# EAGLE schematic re-gotcha (EAGLE 9.5.2)
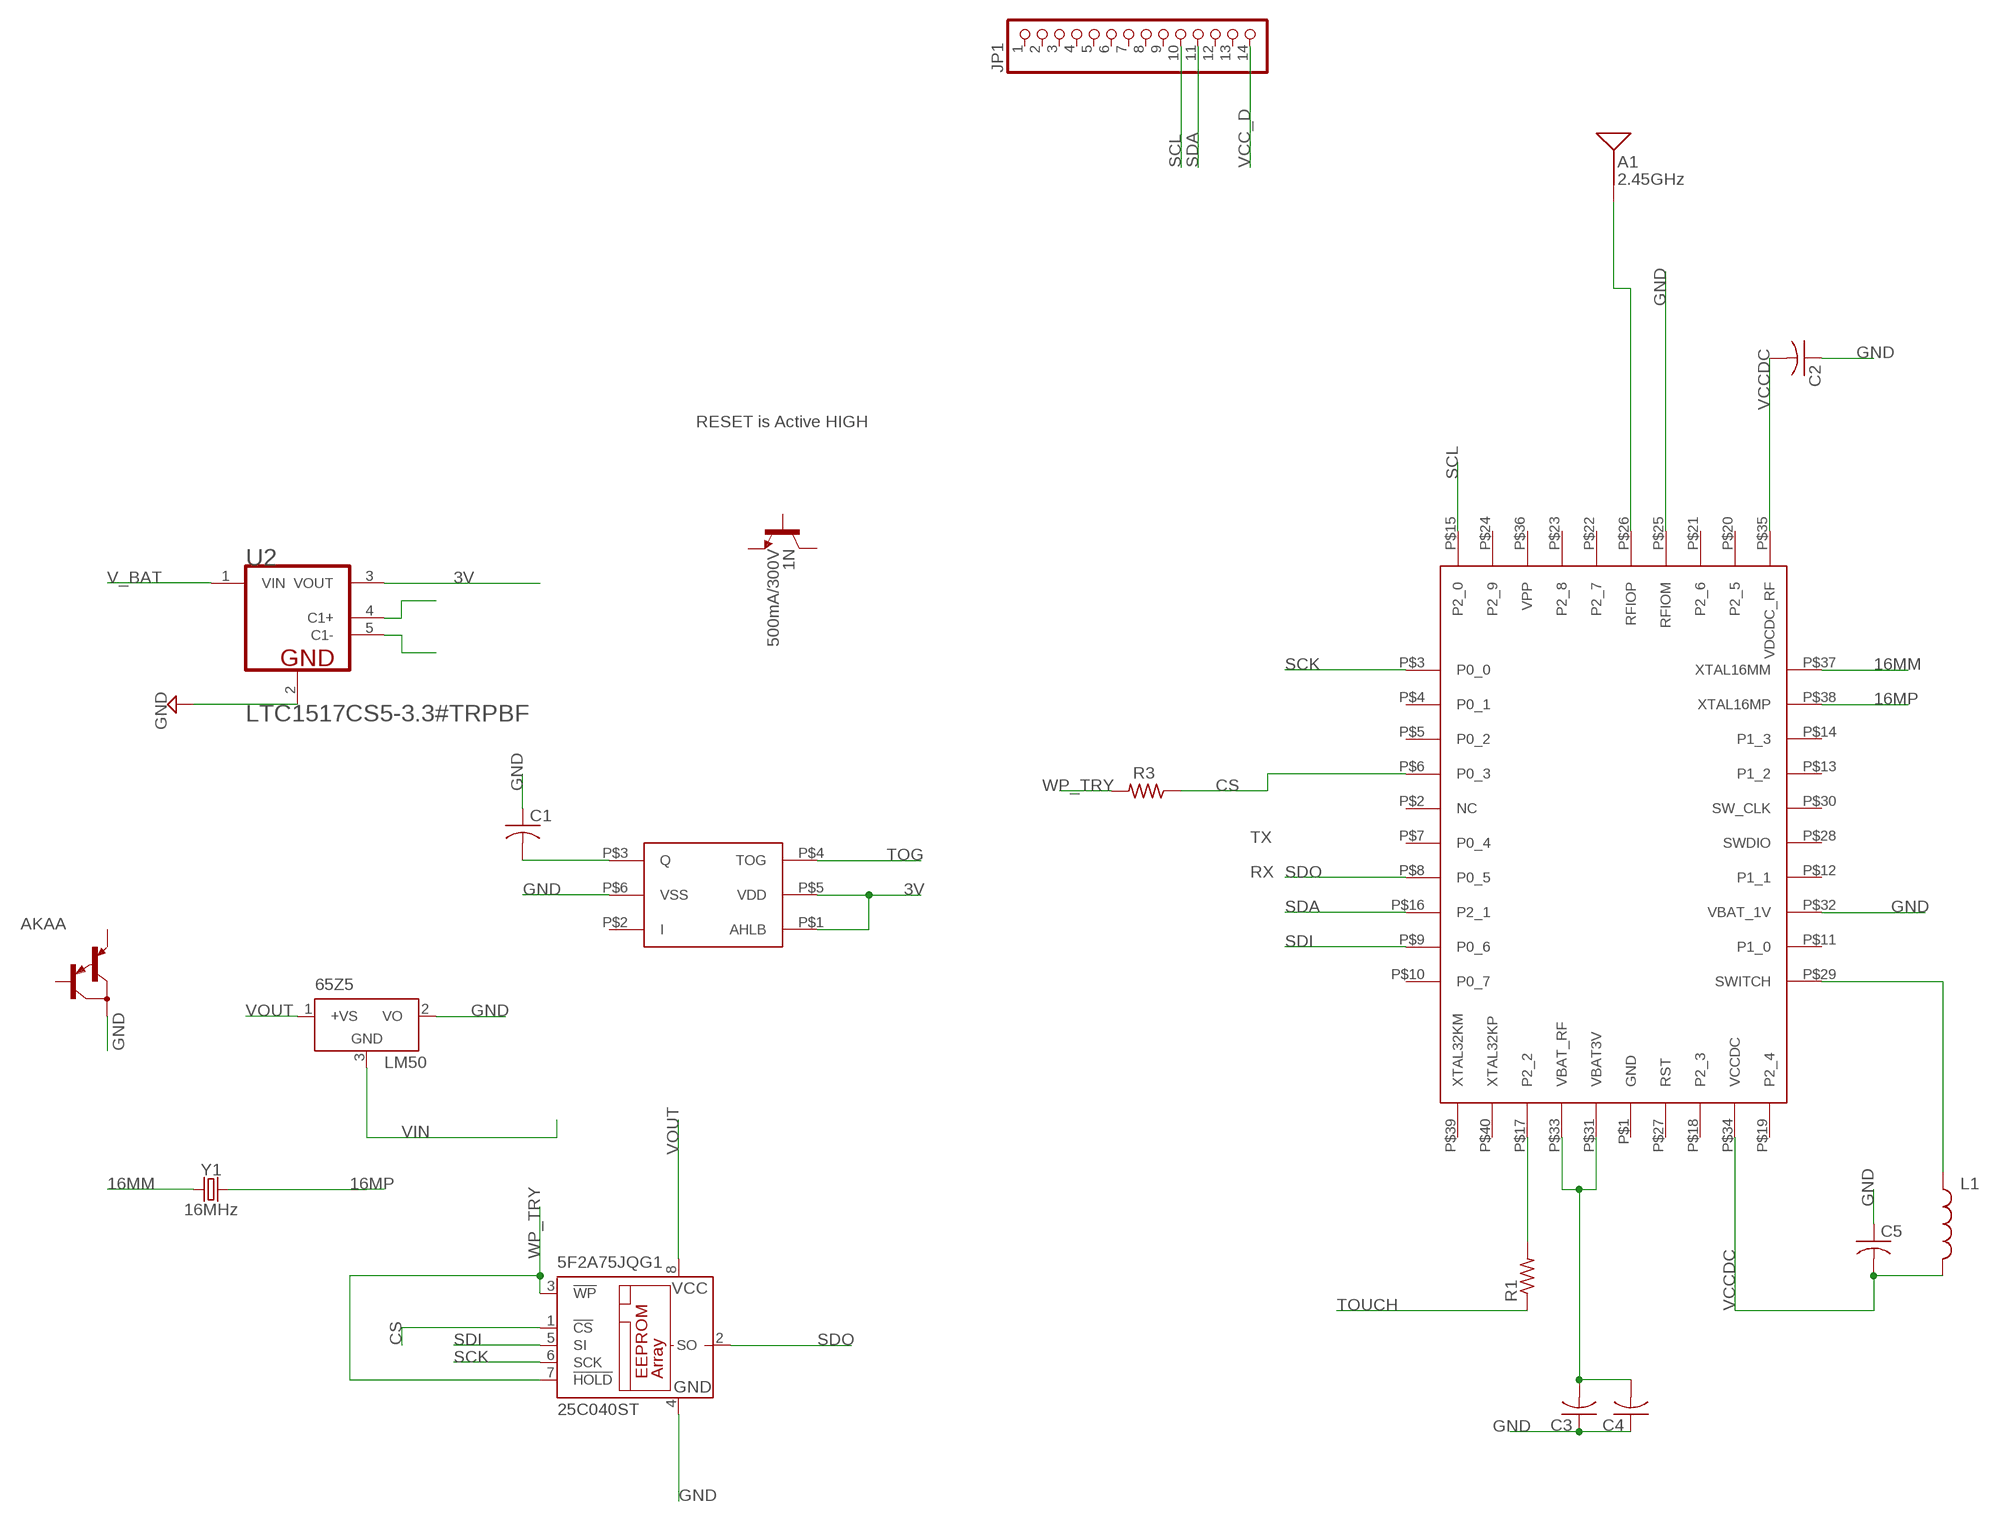
[diagram p0: schematic, sheet 1]

## Parts
1N  500mA/300V  TRANS_NPN-MMBTA42  [SOT23-3]
5F2A75JQG1  25C040ST  [TSSOP8]
65Z5  LM50  [SOT23]
A1  2.45GHz  ANTENNA2.4GHZ-6.5X2.2MM  [ANT-2.4GHZ-6.5X2.2MM]
AKAA  MMBTA64LT1-PNP_DARL-SOT23-BEC  [SOT23-BEC]
C1  C-USC1206  [C1206]
C2  C-US025-024X044  [C025-024X044]
C3  C-US025-024X044  [C025-024X044]
C4  C-US025-024X044  [C025-024X044]
C5  C-US025-024X044  [C025-024X044]
JP1  PINHD-1X14  [1X14]
L1  INDUCTOR  [L0603]
R1  R-US_0204/2V  [0204V]
R3  R-US_0204/2V  [0204V]
U2  LINEAR_TECHNOLOGY_LTC1517CS5-3.3#TRPBFLINEAR_TECHNOLOGY_LTC1517CS5-3.3#TRPBF_0_1  [LINEAR_TECHNOLOGY_LTC1517CS5-3.3#TRPBF_1]
U$1  DA14580  [DA14580]
U$2  233DH  [233DH]
Y1  16MHz  CRYSTAL-16MHZSMD-5X3.2  [CRYSTAL-SMD-5X3.2-4PAD]

## Nets
3V: U2.3(VOUT) U$2.P$1(AHLB) U$2.P$5(VDD)
16MM: U$1.P$37(XTAL16MM) Y1.1
16MP: U$1.P$38(XTAL16MP) Y1.3
CS: 5F2A75JQG1.1(!CS) R3.1 U$1.P$6(P0_3)
GND: 5F2A75JQG1.4(GND) 65Z5.2(VO) AKAA.C C1.1 C2.1 C3.1 C4.1 C5.1 U2.2(GND) U$1.P$25(RFIOM) U$1.P$32(VBAT_1V) U$2.P$6(VSS)
N$1: A1.FEED(SIGNAL) U$1.P$26(RFIOP)
N$2: C1.2 U$2.P$3(Q)
N$9: U2.4(C1+)
N$10: U2.5(C1-)
N$11: R1.2 U$1.P$17(P2_2)
N$12: C3.2 C4.2 U$1.P$31(VBAT3V) U$1.P$33(VBAT_RF)
N$13: L1.1 U$1.P$29(SWITCH)
SCK: 5F2A75JQG1.6(SCK) U$1.P$3(P0_0)
SCL: JP1.10 U$1.P$15(P2_0)
SDA: JP1.11 U$1.P$16(P2_1)
SDI: 5F2A75JQG1.5(SI) U$1.P$9(P0_6)
SDO: 5F2A75JQG1.2(SO) U$1.P$8(P0_5)
TOG: U$2.P$4(TOG)
TOUCH: R1.1
V_BAT: U2.1(VIN)
VCC_D: JP1.14
VCCDC: C2.2 C5.2 L1.2 U$1.P$34(VCCDC) U$1.P$35(VDCDC_RF)
VIN: 65Z5.3(GND)
VOUT: 5F2A75JQG1.8(VCC) 65Z5.1(+VS)
WP_TRY: 5F2A75JQG1.3(!WP) 5F2A75JQG1.7(!HOLD) R3.2
Unconnected: 1N.1(B) 1N.2(E) 1N.3(C) AKAA.B AKAA.E JP1.1 JP1.2 JP1.3 JP1.4 JP1.5 JP1.6 JP1.7 JP1.8 JP1.9 JP1.12 JP1.13 U$1.P$2(NC) U$1.P$4(P0_1) U$1.P$5(P0_2) U$1.P$7(P0_4) U$1.P$10(P0_7) U$1.P$11(P1_0) U$1.P$12(P1_1) U$1.P$13(P1_2) U$1.P$14(P1_3) U$1.P$18(P2_3) U$1.P$19(P2_4) U$1.P$20(P2_5) U$1.P$21(P2_6) U$1.P$22(P2_7) U$1.P$23(P2_8) U$1.P$24(P2_9) U$1.P$27(RST) U$1.P$28(SWDIO) U$1.P$30(SW_CLK) U$1.P$39(XTAL32KM) U$1.P$40(XTAL32KP) U$2.P$2(I)

## Notes on the sheet
- RESET is Active HIGH
- TX
- RX

## Power pins joined to a net without a drawn wire
GND: U$1.P$1(GND)
VPP: U$1.P$36(VPP)

## Library data of the parts
1N = SparkFun-DiscreteSemi:TRANS_NPN: NPN transistor Current controlled devices typically used to amplify current or used as a switch. BC547 - COM-08928 <http://www.sparkfun.com/products/8928> (TO-92 45V 100mA) (1.Collector 2.Base 3.Emitter) 2N3904 - COM-00521 <http://www.sparkfun.com/products/521> (TO-92 40V 200mA) (1.Emitter 2.Base 3.Collector) P2N2222A - COM-12852 <http://www.sparkfun.com/products/12852> (TO-92 40V 600mA) (1.Collector 2.Base 3.Emitter); PROD_ID: TRANS-09116
5F2A75JQG1 = microchip:25*: Serial EEPROM 4K/ 8K , SPI bus; MF: MICROCHIP; MPN: 25C040T/SN; OC_FARNELL: unknown; OC_NEWARK: 30C5312
65Z5 = linear:LM50: SOT-23 Single-Supply Centigrade Temperature Sensor Vout = (10mV/°C x Temp °C) +5mmmV Source: http://cache.national.com/ds/LM/LM50.pdf
A1 = SparkFun-RF:ANTENNA: Single-ended Antennae 2.4GHz and antennae with just one terminal. These are all chip antennae. 2.4GHz (WiFi/BT/ZigBee) Antennae ANT-2.4GHZ-6.5X2.2MM - 6.5 x 2.2 mm chip antenna. (SparkFun Product <https://www.sparkfun.com/products/144>) ANT-2.4GHZ8.0X1.0MM - 8.0 x 1.0 mm chip antenna. (Datasheet <http://www.mouser.com/ds/2/611/antenna_2500at44m0400-242425.pdf>) ANT-2.4GHZ9.5X2.0MM - 9.5 x 2.0 mm chip antenna. (SparkFun Product <https://www.sparkfun.com/products/9025>); PROD_ID: ANT-08187; SF_ID: WRL-00144
AKAA = transistor:*-PNP_DARL-: PNP Darlington Transistor
C1-C5 = adafruit:C-US: CAPACITOR, American symbol
JP1 = adafruit:PINHD-1X14: PIN HEADER
L1 = BeagleBone_Blue_R3:INDUCTOR: Inductors Basic Inductor/Choke - 0603 and 1206. Footprints are not proven and vary greatly between part numbers. SRN6045- 33uH, 20% 1.4A
R1 R3 = adafruit:R-US_: RESISTOR, American symbol
U2 = Linear Technology - LTC1517CS5-3.3#TRPBF:LINEAR_TECHNOLOGY_LTC1517CS5-3.3#TRPBF: LT-LTC1517-XX-S5-5; CIIVA_IDS: 1485929; COMPONENT_LINK_1_DESCRIPTION: Manufacturer URL; COMPONENT_LINK_1_URL: http://www.linear.com/; COMPONENT_LINK_3_DESCRIPTION: Package Specification; COMPONENT_LINK_3_URL: http://cds.linear.com/docs/en/datasheet/17278fb.pdf; DATASHEET: http://cds.linear.com/docs/en/datasheet/15173fs.pdf; FOOTPRINT_VARIANT_NAME_0: Level C; FOOTPRINT_VARIANT_NAME_1: Level B; FOOTPRINT_VARIANT_NAME_2: Level A; FREQUENCYK_HZ: 700; IMPORTED: yes; IMPORTED_FROM: vault; IMPORT_TS: 1521848924; ISHUTDOWNU_A: 1; ISUPPLYM_A: 0.006; MAX_IOUTMA: 15; MF: Linear Technology; MOUNTING_TECHNOLOGY: Surface Mount; MPN: LTC1517CS5-3.3#TRPBF; PACKAGE: S5-5; PACKAGE_DESCRIPTION: 5-Pin Plastic SOT-23, Body 1.625 x 2.90 mm, Pitch 0.95 mm; PACKAGE_VERSION: Aug-07; PACKING: Tape and Reel; PREFIX: U; RELEASE_DATE: 1377785337; ROHS: Yes; VAULT_GUID: 35A07408-7C75-4009-BA10-CE3315D25989; VAULT_REVISION: F491A441-B7F0-4F36-902B-5EA92C58E7C3; VIN_MAXV: 4.4; VIN_MINV: 2; VOUTPUT: 3.3V
U$1 = brandonsmith:DA14580
U$2 = brandonsmith:233DH
Y1 = SparkFun-Clocks:CRYSTAL-16MHZ: 16MHz Crystal Digikey Example <http://www.digikey.com/product-search/en?keywords=535-9122-1-ND> Frequency: 16MHz Frequency Stability: ±50ppm Frequency Tolerance: ±20ppm Load Capacitance: 18pF SparkFun Products: Pro Micro -5V/16MHz <https://www.sparkfun.com/products/12640> SparkFun Serial Enabled LCD Kit <https://www.sparkfun.com/products/10097>; PROD_ID: XTAL-08218; SF_ID: COM-00094